# EAGLE schematic LurkerNanov12 (EAGLE 6.5.0)
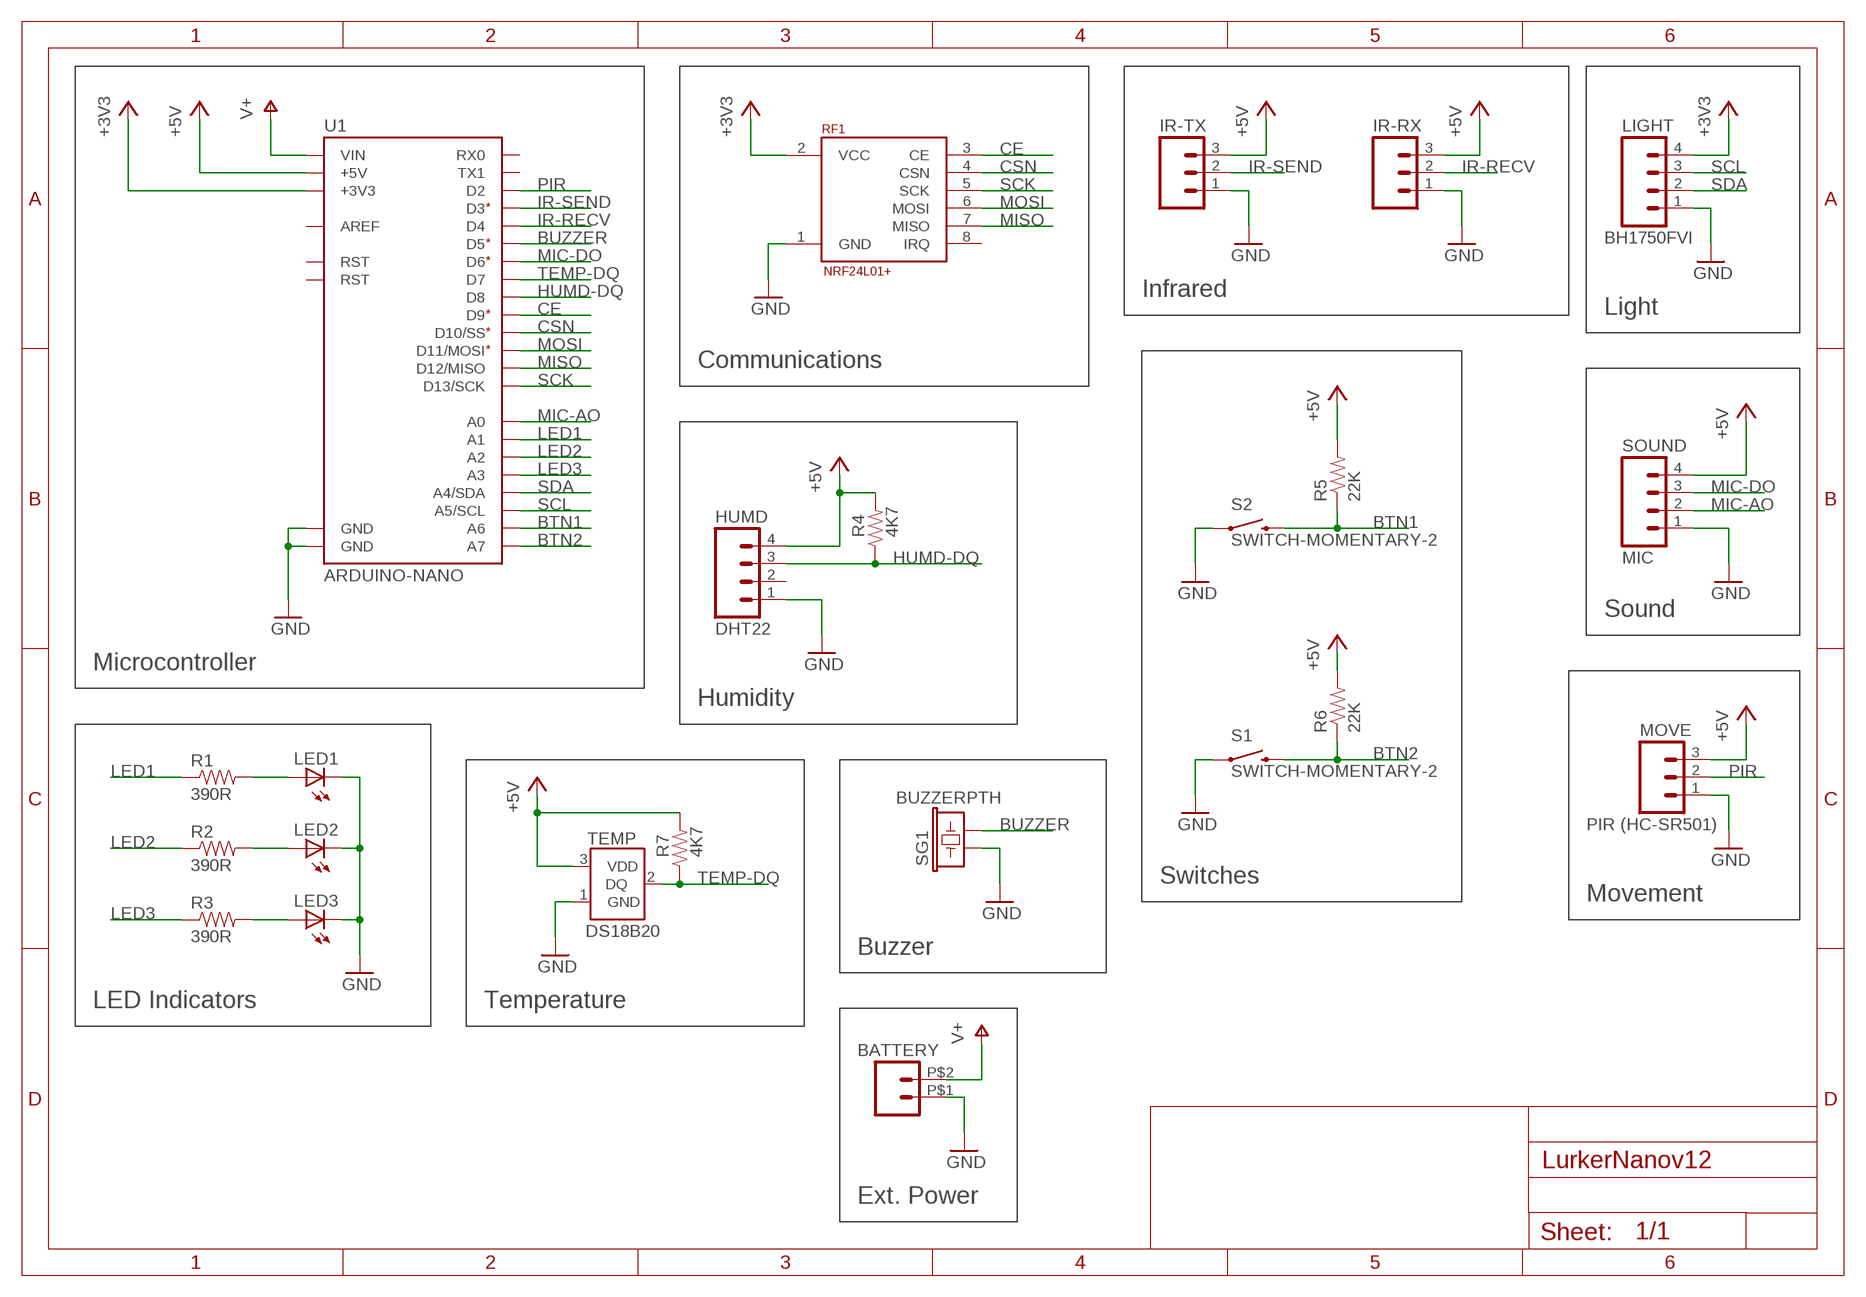
[diagram p0: schematic, sheet 1, part 1 of 2]
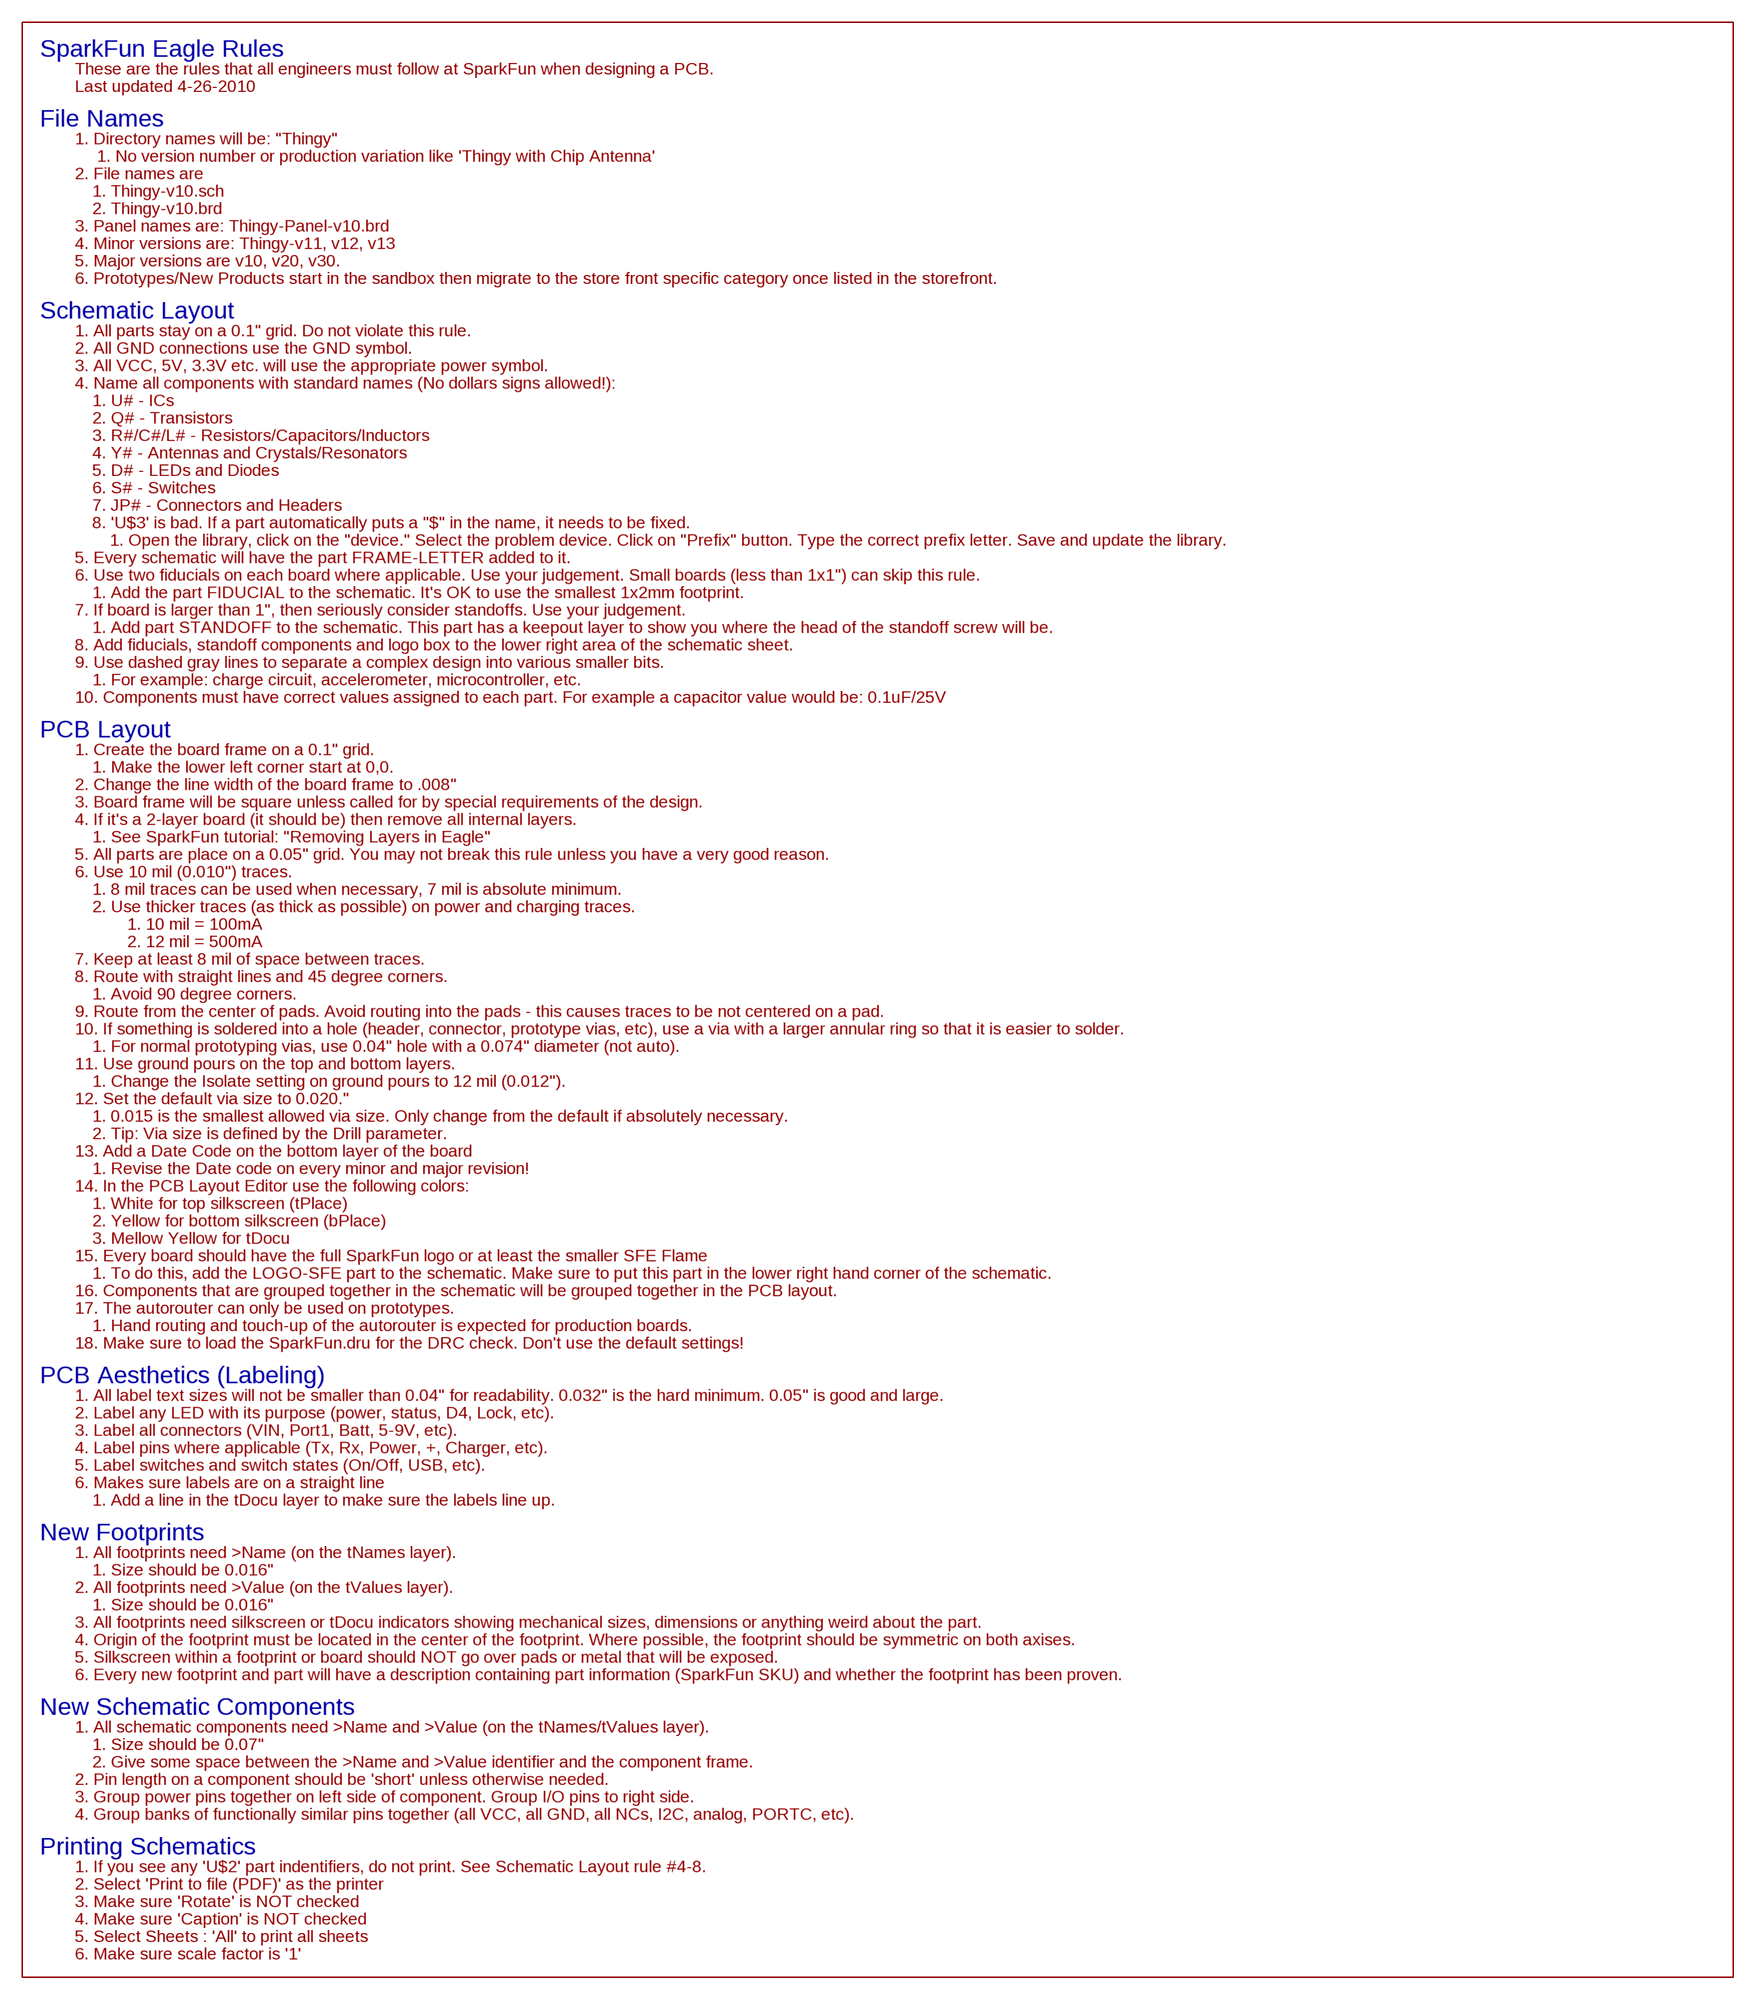
[diagram p1: schematic, sheet 1, part 2 of 2]

## Parts
BATTERY  M02PTH2  [1X02_BIG]
HUMD  DHT22  M04PTH  [1X04]
IR-RX  M03PTH  [1X03]
IR-TX  M03PTH  [1X03]
LED1  LED1206  [LED-1206]
LED2  LED1206  [LED-1206]
LED3  LED1206  [LED-1206]
LIGHT  BH1750FVI  M04PTH  [1X04]
MOVE  PIR (HC-SR501)  M03PTH  [1X03]
R1  390R  RESISTOR1206  [1206]
R2  390R  RESISTOR1206  [1206]
R3  390R  RESISTOR1206  [1206]
R4  4K7  RESISTOR1206  [1206]
R5  22K  RESISTOR1206  [1206]
R6  22K  RESISTOR1206  [1206]
R7  4K7  RESISTOR1206  [1206]
RF1  NRF24L01+  [NRF24L01+-HEADER]
S1  SWITCH-MOMENTARY-2  [TACTILE_SWITCH_TALL]
S2  SWITCH-MOMENTARY-2  [TACTILE_SWITCH_TALL]
SG1  BUZZERPTH  [BUZZER-12MM]
SOUND  MIC  M04PTH  [1X04]
TEMP  DS18B20  [TO-92-AMMO]
U1  ARDUINO-NANO  [NANO-SHIELD]

## Nets
+3V3: LIGHT.4 RF1.2(VCC) U1.3V3(+3V3)
+5V: HUMD.4 IR-RX.3 IR-TX.3 MOVE.3 R4.2 R5.2 R6.2 R7.2 SOUND.4 TEMP.3(VDD) U1.5V(+5V)
BTN1: R5.1 S2.B2 U1.A6
BTN2: R6.1 S1.B2 U1.A7
BUZZER: SG1.- U1.D5
CE: RF1.3(CE) U1.D9
CSN: RF1.4(CSN) U1.D10(D10/SS)
GND: BATTERY.P$1 HUMD.1 IR-RX.1 IR-TX.1 LED1.C LED2.C LED3.C LIGHT.1 MOVE.1 RF1.1(GND) S1.A2 S2.A2 SG1.+ SOUND.1 TEMP.1(GND) U1.GND@0(GND) U1.GND@1(GND)
HUMD-DQ: HUMD.3 R4.1 U1.D8
IR-RECV: IR-RX.2 U1.D4
IR-SEND: IR-TX.2 U1.D3
LED1: R1.1 U1.A1
LED2: R2.1 U1.A2
LED3: R3.1 U1.A3
MIC-AO: SOUND.2 U1.A0
MIC-DO: SOUND.3 U1.D6
MISO: RF1.7(MISO) U1.D12(D12/MISO)
MOSI: RF1.6(MOSI) U1.D11(D11/MOSI)
N$1: LED1.A R1.2
N$2: LED2.A R2.2
N$3: LED3.A R3.2
PIR: MOVE.2 U1.D2
SCK: RF1.5(SCK) U1.D13(D13/SCK)
SCL: LIGHT.3 U1.A5(A5/SCL)
SDA: LIGHT.2 U1.A4(A4/SDA)
TEMP-DQ: R7.1 TEMP.2(DQ) U1.D7
V+: BATTERY.P$2 U1.VIN
Unconnected: HUMD.2 RF1.8(IRQ) U1.REF(AREF) U1.RST U1.RST@0(RST) U1.RX(RX0) U1.TX(TX1)

## Notes on the sheet
- Infrared
- Light
- Communications
- Sound
- Microcontroller
- Humidity
- Switches
- Movement
- Buzzer
- LED Indicators | Temperature
- Ext. Power

## Library data of the parts
BATTERY = SparkFun-Connectors:M02: Header 2 Standard 2-pin 0.1" header. Use with straight break away headers (SKU : PRT-00116), right angle break away headers (PRT-00553), swiss pins (PRT-00743), machine pins (PRT-00117), and female headers (PRT-00115). Molex polarized connector foot print use with SKU : PRT-08233 with associated crimp pins and housings.
HUMD LIGHT SOUND = SparkFun-Connectors:M04: Header 4 Standard 4-pin 0.1" header. Use with straight break away headers (SKU : PRT-00116), right angle break away headers (PRT-00553), swiss pins (PRT-00743), machine pins (PRT-00117), and female headers (PRT-00115). Molex polarized connector foot print use with SKU : PRT-08231 with associated crimp pins and housings. 1MM SMD Version SKU: PRT-10208
IR-RX IR-TX MOVE = SparkFun-Connectors:M03: Header 3 Standard 3-pin 0.1" header. Use with straight break away headers (SKU : PRT-00116), right angle break away headers (PRT-00553), swiss pins (PRT-00743), machine pins (PRT-00117), and female headers (PRT-00115). Molex polarized connector foot print use with SKU : PRT-08232 with associated crimp pins and housings.
LED1-LED3 = SparkFun-LED:LED: LEDs Standard schematic elements and footprints for 5mm, 3mm, 1206, and 0603 sized LEDs. 5mm - Spark Fun Electronics SKU : COM-00529 (and others)
R1-R7 = SparkFun-Resistors:RESISTOR: Resistor Basic schematic elements and footprints for 0603, 1206, and PTH resistors.
RF1 = Leenix:NRF24L01+
S1 S2 = SparkFun-Electromechanical:SWITCH-MOMENTARY-2: Various NO switches- pushbuttons, reed, etc
SG1 = SparkFun-Electromechanical:BUZZER: Buzzer 12mm Spark Fun Electronics SKU : Comp-Buzzer
TEMP = Leenix:DS18B20
U1 = Leenix:ARDUINO-NANO